# Altium schematic sheet Main.SchDoc
size A3; SheetNumber: 1; SheetTotal: 1
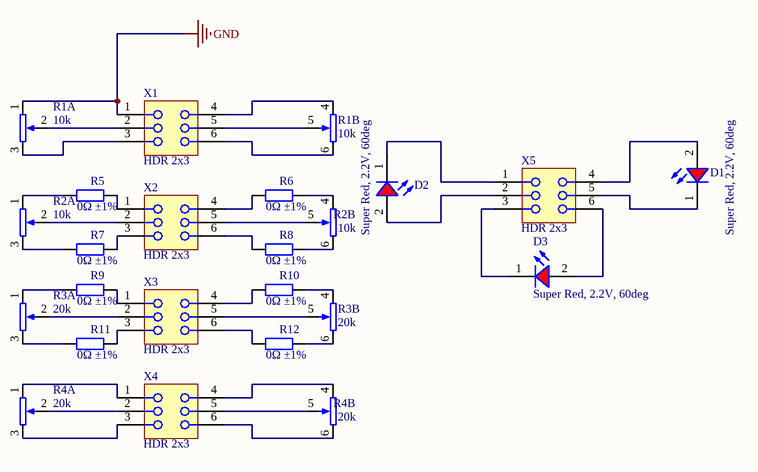
[diagram p0: Main.SchDoc]

## Parts
D1  Super Red, 2.2V, 60deg  [WL-TMRC_3mm_10mm_space]
D2  Super Red, 2.2V, 60deg  [WL-TMRC_3mm_10mm_space]
D3  Super Red, 2.2V, 60deg  [WL-TMRC_3mm_10mm_space]
R1  10k  [RK09L2]  (parts A,B of 2)
R2  10k  [RK09L2]  (parts A,B of 2)
R3  20k  [RK09L2]  (parts A,B of 2)
R4  20k  [RK09L2]  (parts A,B of 2)
R5  0Ω ±1%  [RESC2012X70N]
R6  0Ω ±1%  [RESC2012X70N]
R7  0Ω ±1%  [RESC2012X70N]
R8  0Ω ±1%  [RESC2012X70N]
R9  0Ω ±1%  [RESC2012X70N]
R10  0Ω ±1%  [RESC2012X70N]
R11  0Ω ±1%  [RESC2012X70N]
R12  0Ω ±1%  [RESC2012X70N]
X1  HDR 2x3  [61300621121-poti]
X2  HDR 2x3  [61300621121-poti]
X3  HDR 2x3  [61300621121-poti]
X4  HDR 2x3  [61300621121-poti]
X5  HDR 2x3  [61300621121-poti]

## Nets
GND: R1.1 X1.1
NetD1_1: D1.1(K) X5.5
NetD1_2: D1.2(A) X5.4
NetD2_1: D2.1(K) X5.1
NetD2_2: D2.2(A) X5.2
NetD3_1: D3.1(K) X5.3
NetD3_2: D3.2(A) X5.6
NetR1_2: R1.2 X1.2
NetR1_3: R1.3 X1.3
NetR1_4: R1.4 X1.4
NetR1_5: R1.5 X1.5
NetR1_6: R1.6 X1.6
NetR2_1: R2.1 R5.1
NetR2_2: R2.2 X2.2
NetR2_3: R2.3 R7.1
NetR2_4: R2.4 R6.2
NetR2_5: R2.5 X2.5
NetR2_6: R2.6 R8.2
NetR3_1: R3.1 R9.1
NetR3_2: R3.2 X3.2
NetR3_3: R3.3 R11.1
NetR3_4: R3.4 R10.2
NetR3_5: R3.5 X3.5
NetR3_6: R3.6 R12.2
NetR4_1: R4.1 X4.1
NetR4_2: R4.2 X4.2
NetR4_3: R4.3 X4.3
NetR4_4: R4.4 X4.4
NetR4_5: R4.5 X4.5
NetR4_6: R4.6 X4.6
NetR5_2: R5.2 X2.1
NetR6_1: R6.1 X2.4
NetR7_2: R7.2 X2.3
NetR8_1: R8.1 X2.6
NetR9_2: R9.2 X3.1
NetR10_1: R10.1 X3.4
NetR11_2: R11.2 X3.3
NetR12_1: R12.1 X3.6

## Notes on the sheet
- Title
- Size:
- Date:
- File:
- A4
- Revision:
- Sheet
- of
- Creator:
- Document Type: Schematic Drawing
- Approval Person:

## Library data of the parts
D1-D3 = 151031SS06000_Spacer_10mm: WL-TMRC THT Mono-color Round Color, size 3mm, Super Red, 2.2V, 60deg; Manufacturer: Wurth Elektronik; Peak Wavelength: 650nm; Chip Technology: AlGaAs; Luminous Intensity: 35mcd; Dominant Wavelength: 640nm; ComponentLink1Description: Manufacturer; ComponentLink1URL: http://www.we-online.de; ComponentLink2Description: Datasheet; ComponentLink2URL: https://katalog.we-online.de/led/datasheet/151031SS06000.pdf; Forward Voltage: 2.2V; Size: 3mm; Viewing Angle: 60deg; Manufacturer Part Number: 151031SS06000; Emitting Color: Super Red; Operating Temperature: -40 to +85degC; Mounting Technology: THT; Packaging: Bulk; Published Date: October 2019
R1 R2 = POT_10k_log_dual: Potentiometers 10K VERTICAL dual, log, audio; Manufacturer: BI Technologies / TT Electronics; Manufacturer Part Number: P0925N-FC15AR10K; Tolerance: 20%
R3 R4 = POT_20k_lin_dual: Potentiometer 1/20W 20K Ohms 20% 9mm ROTARY POT; Manufacturer: BI Technologies / TT Electronics; Manufacturer Part Number: P0925N-FC15BR20K; Tolerance: 20%
R5-R12 = 0805 0R (0R0) 1%: Chip resistor; Manufacturer Part Number: CRCW08050000Z0EAC; Manufacturer: Vishay / Dale; Alternatives allowed: YES; Tolerance: 1%; JLC: C17477
X1-X5 = CON_HEADER_2x3_Poti: Stiftleiste, vertikal, Board-to-Board, 2.54 mm, 2 Reihe(n), 6 Kontakt(e), Durchsteckmontage, gerade; Manufacturer: WE; Manufacturer Part Number: 613004216921; Alternatives allowed: YES